# Altium schematic sheet pwr_dc-dc.SchDoc: =GlobalProjectName
size 209 x 297 mm; SheetNumber: 4; SheetTotal: 7; PageSetup: Record=PageOptions|CenterHorizontal=True|CenterVertical=True|PrintScale=1.00|XCorrection=1.00|YCorrection=1.00|PrintKind=1|BorderSize=5000000|LeftOffset=0|BottomOffset=0|Orientation=2|PaperLength=1000|PaperWidth=1000|Scale=100|PaperSource=15|PrintQuality=1200|MediaType=1|DitherType=10|PaperKind=A3|PrintScaleMode=1; Weight: -; ScaleFactor: -
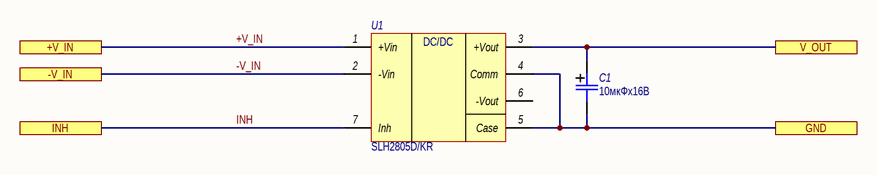
[diagram p0: pwr_dc-dc.SchDoc]

## Parts
C1  10мкФх16В  [SMD_size_B]
U1  Наименование: SLH2805D/KR  [SLH28xx]  (hidden comment: SLH28xx)

## Ports
+V_IN, -V_IN, GND, INH, V_OUT

## Nets
+V_IN: U1.1(+Vin) ; port +V_IN
-V_IN: U1.2(-Vin) ; port -V_IN
GND: C1.2 U1.4(Comm) U1.5(Case) ; port GND
INH: U1.7(Inh) ; port INH
V_OUT: C1.1 U1.3(+Vout) ; port V_OUT

Not connected (* = marked no-connect by the designer): U1 6(-Vout)

## Notes on the sheet
- Подп. и дата
- Инв. № дубл.
- Взам. инв. №
- Инв. № подл.
- Изм.
- Лист
- № докум.
- Подп.
- Дата
- Форма 2а ГОСТ 2.104-2006
- Копировал
- Формат А4
- (in symbol SLH28xx) DC/DC

## Library data of the parts
C1 = Capacitor_pol: Polarized capacitor; Назначение: Поляризованный SMD-конденсатор; Наименование: Поляризованный конденсатор; Потребление, Вт: 0; Value: 10мкФх16В
U1 = SLH28xx: DC-DC; Назначение: DC-DC преобразователь; Потребление, Вт: 0.1; ComponentLink1Description: DataSheet; ComponentLink1URL: https://www.interpoint.com/product_documents/SLH_Space_DC_DC_Converters.pdf